# Altium schematic sheet BoardIOModule.SchDoc: Board IO/Connectors Module
size A; DrawnBy: J. Sullivan; Engineer: J. Sullivan; SheetNumber: 5; SheetTotal: 13; ENG_APP_DATE: 7/26/22
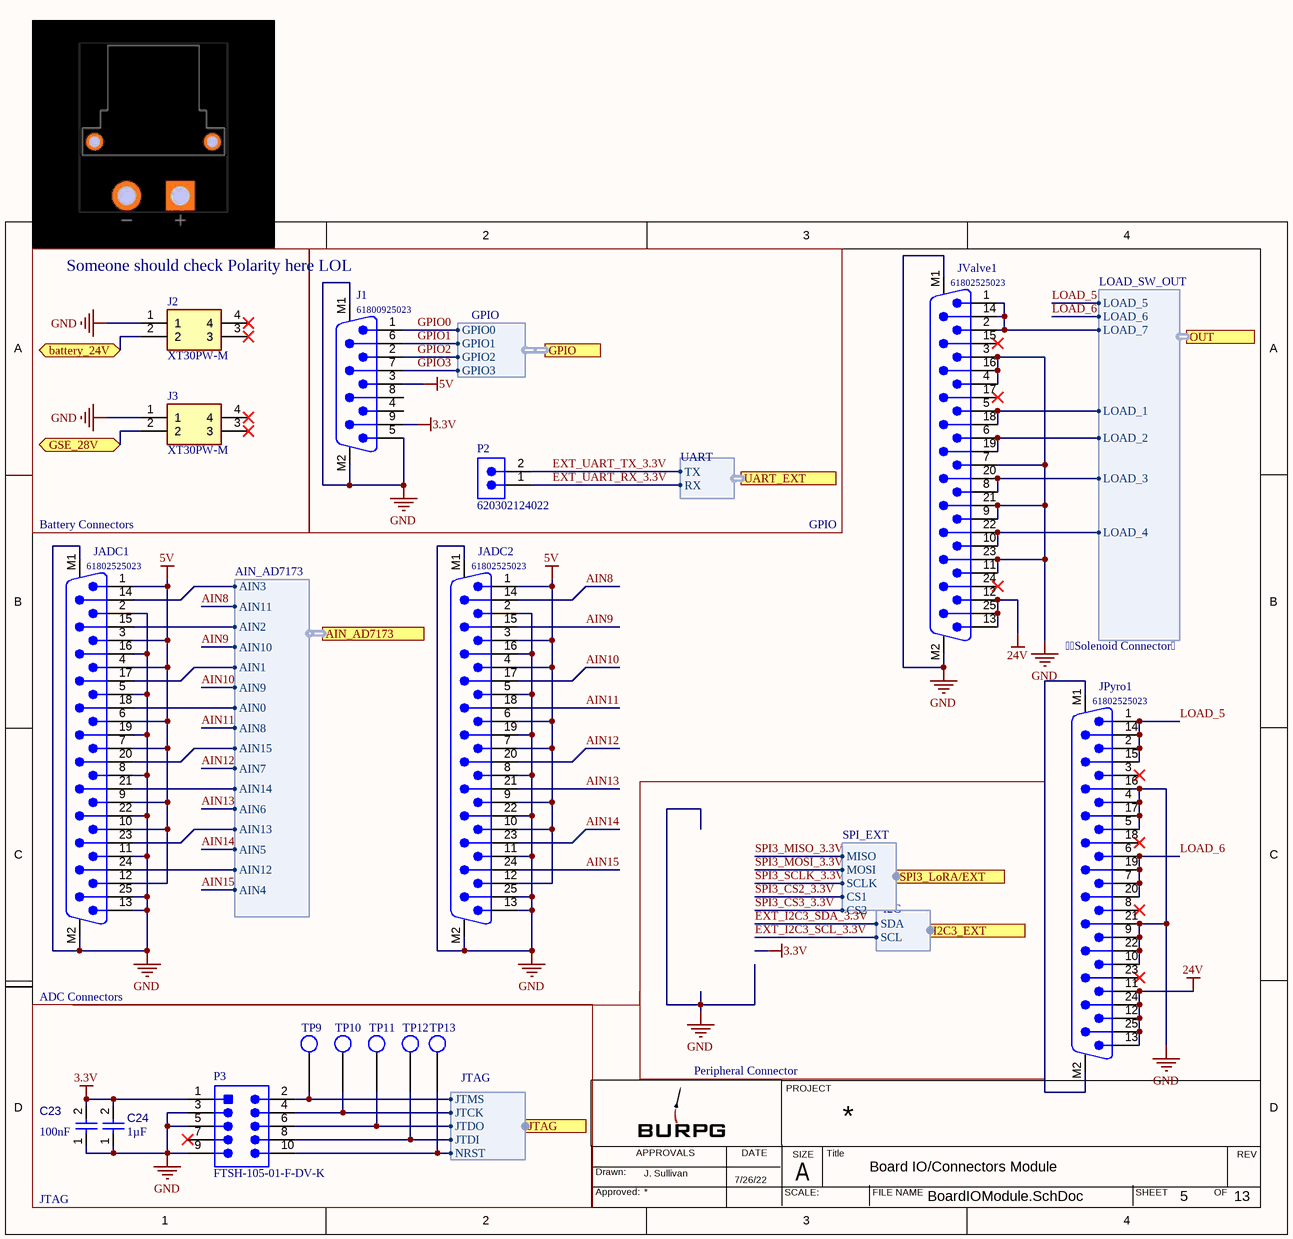
[diagram p0: BoardIOModule.SchDoc]

## Parts
C23  value 100nF  [CAPC1005X56X25LL10T15]  (hidden comment: CAP-NP-2)
C24  value 1µF  [CAPC1608X90X35ML15T15]  (hidden comment: CAP-NP-2)
J1  61800925023  [61800925023]
J2  XT30PW-M  [XT30PWM]
J3  XT30PW-M  [XT30PWM]
JADC1  61802525023  [61802525023]
JADC2  61802525023  [61802525023]
JPyro1  61802525023  [61802525023]
JValve1  61802525023  [61802525023]
P2  620302124022  [620302124022]
P3  FTSH-105-01-F-DV-K  [SMTC-FTSH-105-01-L-DV-K_V]
TP9  BURPG_TestPoint1  [BURPG_TestPoint1]  (value not drawn)  (no BOM)
TP10  BURPG_TestPoint1  [BURPG_TestPoint1]  (value not drawn)  (no BOM)
TP11  BURPG_TestPoint1  [BURPG_TestPoint1]  (value not drawn)  (no BOM)
TP12  BURPG_TestPoint1  [BURPG_TestPoint1]  (value not drawn)  (no BOM)
TP13  BURPG_TestPoint1  [BURPG_TestPoint1]  (value not drawn)  (no BOM)

## Blocks framed on the sheet
Someone should check Polarity here LOL: J2 J3
GPIO: J1 P2

## Ports
AIN_AD7173 (harness AIN_AD7173), battery_24V (bidir), GPIO (harness GPIO), GSE_28V (bidir), I2C3_EXT (harness I2C), JTAG (harness JTAG), OUT (harness LOAD_SW_OUT), SPI3_LoRA/EXT (harness SPI_EXT), UART_EXT (harness UART)

## Harnesses
LOAD_SW_OUT: LOAD_1, LOAD_2, LOAD_3, LOAD_4, LOAD_5, LOAD_6, LOAD_7
I2C: SDA, SCL
UART: TX, RX
SPI_EXT: MISO, MOSI, CS1, SCLK, CS2
JTAG: JTDO, JTMS, JTCK, JTDI, NRST
GPIO: GPIO0, GPIO1, GPIO2, GPIO3
AIN_AD7173: AIN3, AIN2, AIN1, AIN0, AIN15, AIN14, AIN13, AIN12, AIN11, AIN10, AIN9, AIN8, AIN7, AIN6, AIN5, AIN4

## Nets
3.3V: C23.2 C24.2 J1.9 P3.1
5V: J1.3 JADC1.1 JADC1.3 JADC1.4 JADC1.6 JADC1.7 JADC1.9 JADC1.10 JADC1.12 JADC2.1 JADC2.3 JADC2.4 JADC2.6 JADC2.7 JADC2.9 JADC2.10 JADC2.12
24V: JPyro1.11 JPyro1.12 JPyro1.13 JPyro1.24 JPyro1.25 JValve1.12 JValve1.13 JValve1.25
GND: C23.1 C24.1 J1.5 J1.M1 J1.M2 J2.1 J3.1 JADC1.2 JADC1.5 JADC1.8 JADC1.11 JADC1.13 JADC1.16 JADC1.19 JADC1.22 JADC1.25 JADC1.M1 JADC1.M2 JADC2.2 JADC2.5 JADC2.8 JADC2.11 JADC2.13 JADC2.16 JADC2.19 JADC2.22 JADC2.25 JADC2.M1 JADC2.M2 JPyro1.4 JPyro1.5 JPyro1.9 JPyro1.10 JPyro1.16 JPyro1.17 JPyro1.21 JPyro1.22 JValve1.3 JValve1.4 JValve1.7 JValve1.9 JValve1.11 JValve1.16 JValve1.21 JValve1.23 JValve1.M1 JValve1.M2 P3.3 P3.5 P3.9
AIN8: JADC2.14 ; port AIN_AD7173.AIN11
AIN9: JADC2.15 ; port AIN_AD7173.AIN10
AIN10: JADC2.17 ; port AIN_AD7173.AIN9
AIN11: JADC2.18 ; port AIN_AD7173.AIN8
AIN12: JADC2.20 ; port AIN_AD7173.AIN7
AIN13: JADC2.21 ; port AIN_AD7173.AIN6
AIN14: JADC2.23 ; port AIN_AD7173.AIN5
AIN15: JADC2.24 ; port AIN_AD7173.AIN4
battery_24V: J2.2 ; port battery_24V
EXT_I2C3_SCL_3.3V: port I2C3_EXT.SCL
EXT_I2C3_SDA_3.3V: port I2C3_EXT.SDA
EXT_UART_RX_3.3V: P2.1 ; port UART_EXT.RX
EXT_UART_TX_3.3V: P2.2 ; port UART_EXT.TX
GPIO0: J1.1 ; port GPIO.GPIO0
GPIO1: J1.6 ; port GPIO.GPIO1
GPIO2: J1.2 ; port GPIO.GPIO2
GPIO3: J1.7 ; port GPIO.GPIO3
GSE_28V: J3.2 ; port GSE_28V
LOAD_5: JPyro1.1 JPyro1.2 JPyro1.14 JPyro1.15 ; port OUT.LOAD_5
LOAD_6: JPyro1.6 JPyro1.7 JPyro1.19 JPyro1.20 ; port OUT.LOAD_6
SPI3_CS2_3.3V: port SPI3_LoRA/EXT.CS1
SPI3_CS3_3.3V: port SPI3_LoRA/EXT.CS2
SPI3_MISO_3.3V: port SPI3_LoRA/EXT.MISO
SPI3_MOSI_3.3V: port SPI3_LoRA/EXT.MOSI
SPI3_SCLK_3.3V: port SPI3_LoRA/EXT.SCLK
NetJADC1_14: JADC1.14 ; port AIN_AD7173.AIN3
NetJADC1_15: JADC1.15 ; port AIN_AD7173.AIN2
NetJADC1_17: JADC1.17 ; port AIN_AD7173.AIN1
NetJADC1_18: JADC1.18 ; port AIN_AD7173.AIN0
NetJADC1_20: JADC1.20 ; port AIN_AD7173.AIN15
NetJADC1_21: JADC1.21 ; port AIN_AD7173.AIN14
NetJADC1_23: JADC1.23 ; port AIN_AD7173.AIN13
NetJADC1_24: JADC1.24 ; port AIN_AD7173.AIN12
NetJPyro1_M1: JPyro1.M1 JPyro1.M2
NetJValve1_1: JValve1.1 JValve1.2 JValve1.14 ; port OUT.LOAD_7
NetJValve1_5: JValve1.5 JValve1.18 ; port OUT.LOAD_1
NetJValve1_6: JValve1.6 JValve1.19 ; port OUT.LOAD_2
NetJValve1_8: JValve1.8 JValve1.20 ; port OUT.LOAD_3
NetJValve1_10: JValve1.10 JValve1.22 ; port OUT.LOAD_4
NetP3_2: P3.2 TP9.1 ; port JTAG.JTMS
NetP3_4: P3.4 TP10.1 ; port JTAG.JTCK
NetP3_6: P3.6 TP11.1 ; port JTAG.JTDO
NetP3_8: P3.8 TP12.1 ; port JTAG.JTDI
NetP3_10: P3.10 TP13.1 ; port JTAG.NRST

Not connected (* = marked no-connect by the designer): J1 4 8; J2 3* 4*; J3 3* 4*; JPyro1 3* 8* 18* 23*; JValve1 15* 17* 24*; P3 7*

## Notes on the sheet
- (near JADC1) Battery Connectors
- Solenoid Connector
- ADC Connectors
- Peripheral Connector
- JTAG
- PROJECT
- Drawn:
- Approved:
- APPROVALS
- DATE
- SCALE:
- SIZE
- A
- Title
- FILE NAME
- SHEET
- OF
- REV

## Library data of the parts
C23 = CMP-001-00001-6: Chip Capacitor, 0.1 uF, +/- 5%, 16 V, 0402 (1005 Metric); Capacitor Type: Ceramic; Voltage Rating: 16V; Case/Package: 0402; Max Operating Temperature: 125°C; Min Operating Temperature: -55°C; Mounting Technology: SM; Pins: 2; RoHS Compliant: True; Tolerance: 5%
C24 = CMP-001-00004-6: Chip Capacitor, 1 uF, +/- 10%, 16 V, 0603 (1608 Metric); Capacitor Type: Ceramic; Voltage Rating: 16V; Case/Package: 0603; Max Operating Temperature: 125°C; Min Operating Temperature: -55°C; Mounting Technology: SM; Pins: 2; RoHS Compliant: True; Tolerance: 10%
J1 = CMP-1502-00276-1: Male PCB Connector WR-DSUB, Vertical, 9 pins; Manufacturer: Wurth Elektronik; Rated Current: 3A; Working Voltage: 125VAC; Pin Number: 9; Contact Resistance: 30mOhm; Part Number: 61800925023; Gender: Male; Datasheet URL: https://katalog.we-online.de/em/datasheet/6180xx25023.pdf; Manufacturer URL: http://www.we-online.de; Package Reference: 61800925023; Mounting Technology: THT; Operating Temperature: -40to85degC; Orientation: Vertical; Packaging: Tray; Publisher: WurthElektronik
J2 J3 = XT30PW-M: Connector; Manufacturer_Name: Amass; Datasheet Link: https://www.tme.eu/sl/Document/ce4077e36b79046da520ca73227e15de/XT30PW%20SPEC.pdf; Height: 5mm; Manufacturer_Part_Number: XT30PW-M
JADC1 JADC2 JPyro1 JValve1 = CMP-1502-00278-1: Male PCB Connector WR-DSUB, Vertical, 25 pins; Manufacturer: Wurth Elektronik; Working Voltage: 125VAC; Rated Current: 3A; Pin Number: 25; Contact Resistance: 30mOhm; Operating Temperature: -40to85degC; Gender: Male; Publisher: WurthElektronik; Packaging: Tray; Orientation: Vertical; Manufacturer URL: http://www.we-online.de; Mounting Technology: THT; Package Reference: 61802525023; Part Number: 61802525023; Datasheet URL: https://katalog.we-online.de/em/datasheet/6180xx25023.pdf
P2 = CMP-1502-00660-2: NexarPartId: 18818242; Insulation: Insulated; Connector Type: Male Pin; Pitch: 2mm; Insulation Resistance: 1GΩ; Gender: Male; Voltage Rating: 125V; Number of Positions: 2; Contact Resistance: 20mΩ; Operating Supply Voltage: 100V; Current Rating: 2A; Contact Material: Copper; Number of Rows: 1; Flammability Rating: UL94 V-0; Housing Material: Nylon; Lead Pitch: 2mm; Orientation: Vertical; Max Operating Temperature: 85°C; Termination: SMD/SMT; REACH SVHC: Unknown; Contact Mating Length: 3.5052mm; RoHS: Compliant; Packaging: Tape and Reel; Number of Contacts: 2; Height: 6.6mm; Mount: Surface Mount; Number of Pins: 2; Contact Gender: Male; Min Operating Temperature: -40°C; Length: 5mm; Width: 7.9mm; Contact Plating: Tin; Color: Beige, White
P3 = CMP-2000-05352-1: Male Header, Pitch 1.27 mm, 2 x 5 Position, Height 6.12 mm, RoHS, Tube; Manufacturer: Samtec; Number of Positions: 10; Connector Type: Header,Shrouded; Number of Positions Loaded: All; Row Spacing: 0.050"(1.27mm); Fastening Type: -; Package Reference: FTSH-105-01-L-DV-K; Termination: Solder; Package URL: http://suddendocs.samtec.com/prints/ftsh-1xx-xx-xxx-dv-xxx-footprint.pdf; Number of Rows: 2; Contact Finish Thickness: 3µin(0.08µm); Contact Type: MalePin; Manufacturer URL: http://www.samtec.com/; Contact Mating Length: 0.120"(3.05mm); Pitch: 0.050"(1.27mm); Series: FTSH; Features: -; Contact Finish: Gold; Color: Black; Family: RectangularConnectors-Headers,MalePins; Datasheet URL: http://suddendocs.samtec.com/prints/ftsh-1xx-xx-xxx-dv-xxx-mkt.pdf; Package Description: Male Header, Pitch 1.27 mm, 2 x 5 Position, Height 5.97 mm, Tail Length 4.32 mm; Mounting Type: SurfaceMount; Datasheet Version: Rev. ET, 10/1995; Category: Connectors,Interconnects; Packaging: Tube